# EAGLE schematic triacTriggerCpuBoard (EAGLE 7.2.0)
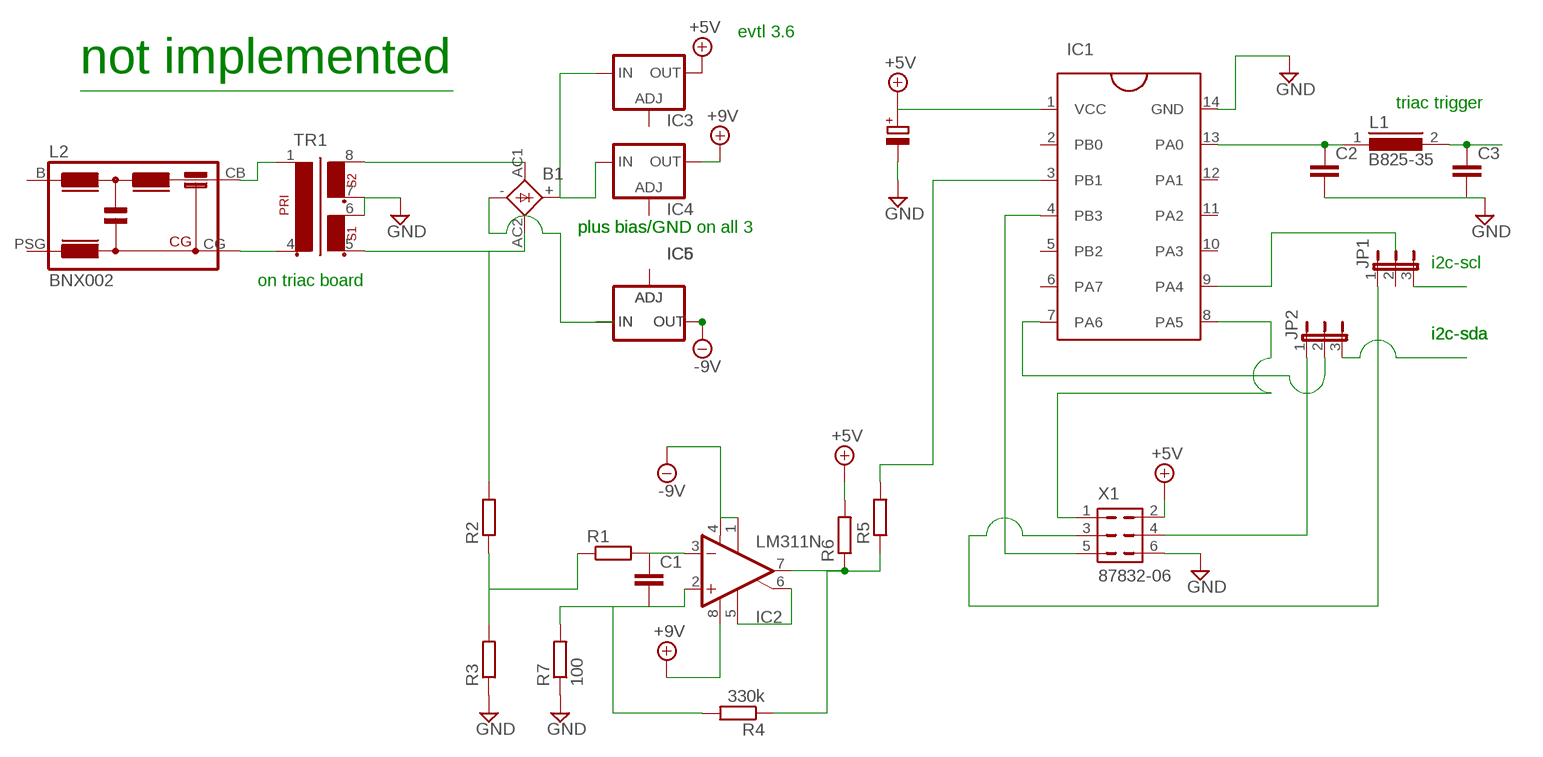
[diagram p0: schematic, sheet 1]

## Parts
B1  2KBB-R  [2KBB-R]
C1  C2,5-3  [C2.5-3]
C2  C2,5-3  [C2.5-3]
C3  C2,5-3  [C2.5-3]
IC1  ATTINY4414P3  [DIL14]
IC2  LM311N  [DIL08]
IC3  LM317-TO3  [TO3-K02]
IC4  LM317-TO3  [TO3-K02]
IC5  LM337TS  [337TS]
IC6  LM337TS  [337TS]
JP1  JP2E  [JP2]
JP2  JP2E  [JP2]
L1  B825-35  [B825-35]
L2  BNX002  [BNX002]
R1  R-EU_0207/10  [0207/10]
R2  R-EU_0207/10  [0207/10]
R3  R-EU_0207/10  [0207/10]
R4  330k  R-EU_0207/10  [0207/10]
R5  R-EU_0207/10  [0207/10]
R6  R-EU_0207/10  [0207/10]
R7  100  R-EU_0207/10  [0207/10]
TR1  EE20-2  [EE20-2]
X1  87832-06  [87832-06]

## Nets
+5V: IC1.1(VCC) IC3.3(OUT) R6.2 X1.2
+9V: IC2.8(V+) IC4.3(OUT)
-9V: IC2.1(GND) IC2.4(V-) IC5.3(OUT) IC6.3(OUT)
GND: C2.2 IC1.14(GND) R3.1 R7.1 TR1.6 TR1.7 X1.6
N$1: JP1.3
N$2: JP2.1 X1.4
N$3: IC1.7(PA6) JP2.2
N$4: IC1.4(PB3) X1.5
N$5: JP1.1 X1.3
N$6: B1.AC2 R2.2 TR1.5
N$7: JP2.3
N$8: B1.AC1 TR1.8
N$9: IC1.8(PA5) X1.1
N$10: C1.2 IC2.2(+IN) R4.2 R7.2
N$11: C1.1 IC2.3(-IN) R1.2
N$12: C3.1 L1.2
N$13: IC2.5(ON) IC2.6(ON/STR)
N$14: IC1.3(PB1) R5.2
N$15: IC2.7(OUT) R4.1 R5.1 R6.1
N$16: IC5.1(ADJ) IC6.1(ADJ)
N$17: R1.1 R2.1 R3.2
N$18: B1.+ IC3.1(IN) IC4.1(IN)
N$19: B1.- IC5.2(IN) IC6.2(IN)
N$20: C2.1 IC1.13(PA0) L1.1
N$21: IC1.9(PA4)
N$22: L2.CG TR1.4
N$23: L2.CB TR1.1
Unconnected: C3.2 IC1.2(PB0) IC1.5(PB2) IC1.6(PA7) IC1.10(PA3) IC1.11(PA2) IC1.12(PA1) IC3.2(ADJ) IC4.2(ADJ) JP1.2 L2.B L2.PSG

## Notes on the sheet
- evtl 3.6
- not implemented
- triac trigger
- plus bias/GND | plus bias/GND on all 3
- i2c-scl
- on triac board
- i2c-sda | i2c-sda

## Library data of the parts
B1 = rectifier:2KBB-R: RECTIFIER grid 3 x 5 mm
C1-C3 = capacitor-wima:C: CAPACITOR naming: grid - package width
IC1 = atmel-new:ATTINY44: Source: http://www.atmel.com/dyn/resources/prod_documents/doc8183.pdf
IC2 = linear:LM311: COMPARATOR
IC3 IC4 = v-reg:LM317-TO3: VOLTAGE REGULATOR
IC5 IC6 = v-reg:LM337TS: VOLTAGE REGULATOR
JP1 JP2 = jumper:JP2E: JUMPER
L1 = inductors:B825-35: INDUCTOR
L2 = inductors:BNX002: FILTER
R1-R7 = resistor:R-EU_: RESISTOR, European symbol
TR1 = trafo:EE20-2: TRANSFORMER 1 primary winding, 2 secondary windings ERA
X1 = con-molex:87832-06: Milli-Grid Header 2.00mm (.079") Pitch; OC_FARNELL: 1756947; OC_NEWARK: unknown